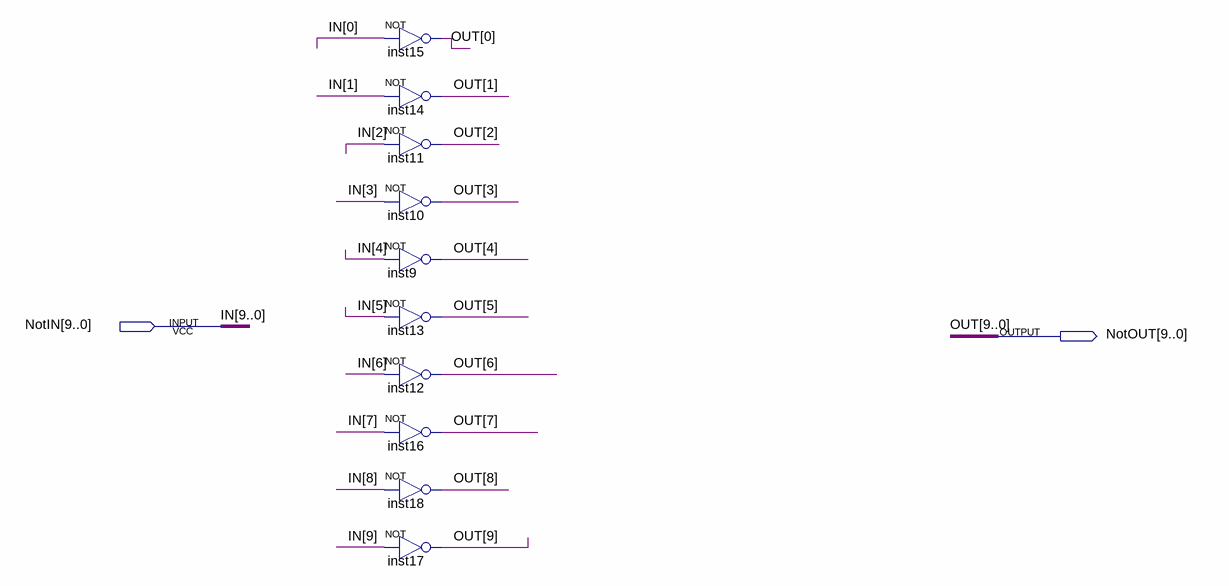
[diagram p0: schematic sheet]
// Quartus schematic not10.bdf as structural Verilog: 10 symbols, 2 pins
module not10 (
  input  [9:0] NotIN,
  output [9:0] NotOUT
);

  not inst15 (NotOUT[0], NotIN[0]);
  not inst14 (NotOUT[1], NotIN[1]);
  not inst11 (NotOUT[2], NotIN[2]);
  not inst10 (NotOUT[3], NotIN[3]);
  not inst9 (NotOUT[4], NotIN[4]);
  not inst13 (NotOUT[5], NotIN[5]);
  not inst12 (NotOUT[6], NotIN[6]);
  not inst16 (NotOUT[7], NotIN[7]);
  not inst18 (NotOUT[8], NotIN[8]);
  not inst17 (NotOUT[9], NotIN[9]);

  // Other names for the same wires on the sheet: IN[9:0] = NotIN; OUT[9:0] = NotOUT
endmodule
